# EAGLE design display (EAGLE 7.2.0)
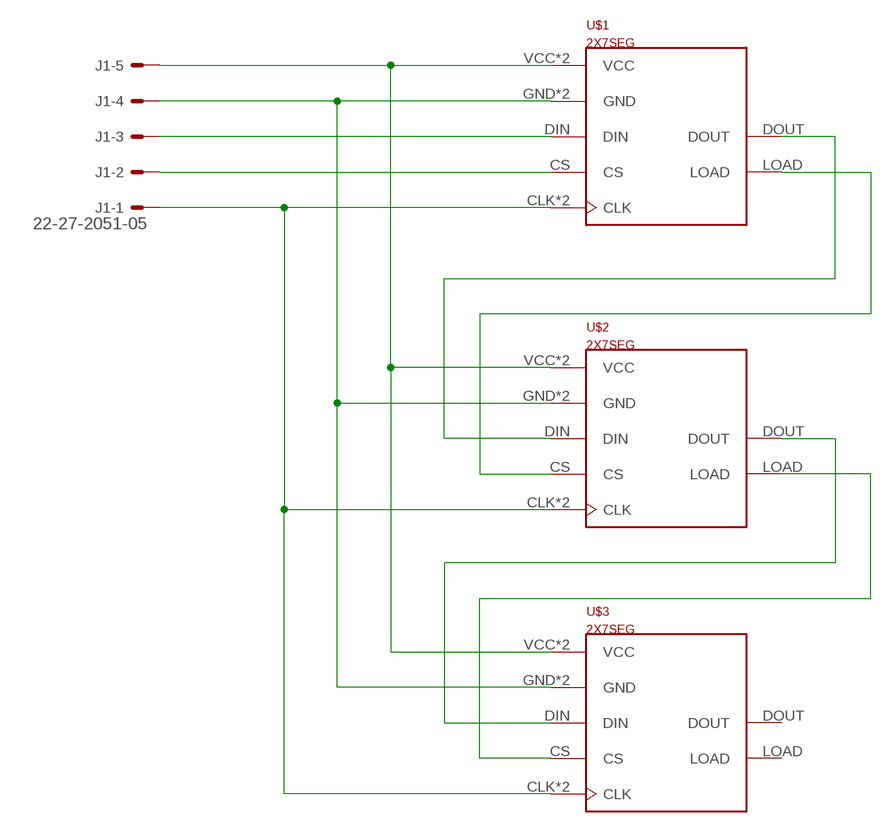
[diagram p0: schematic, sheet 1]

## Parts
J1  22-27-2051-05  [6410-05]
U$1  2X7SEG  [2X7SEG]
U$2  2X7SEG  [2X7SEG]
U$3  2X7SEG  [2X7SEG]

## Nets
N$1: J1.5 U$1.VCC U$1.VCC2(VCC) U$2.VCC U$2.VCC2(VCC) U$3.VCC U$3.VCC2(VCC)
N$2: J1.2 U$1.CS
N$3: J1.3 U$1.DIN
N$5: J1.1 U$1.CLK U$1.CLK2(CLK) U$2.CLK U$2.CLK2(CLK) U$3.CLK U$3.CLK2(CLK)
N$6: U$1.DOUT U$2.DIN
N$7: U$1.LOAD U$2.CS
N$8: U$2.DOUT U$3.DIN
N$9: U$2.LOAD U$3.CS
N$10: J1.4 U$1.GND U$1.GND2(GND) U$2.GND U$2.GND2(GND) U$3.GND U$3.GND2(GND)
Unconnected: U$3.DOUT U$3.LOAD

## Library data of the parts
J1 = con-molex:22-?-05: CONNECTOR wire to board 2.54 mm (.1 inch) pitch header; OC_FARNELL: unknown; OC_NEWARK: unknown
U$1-U$3 = arduino:2X7SEG

## Board
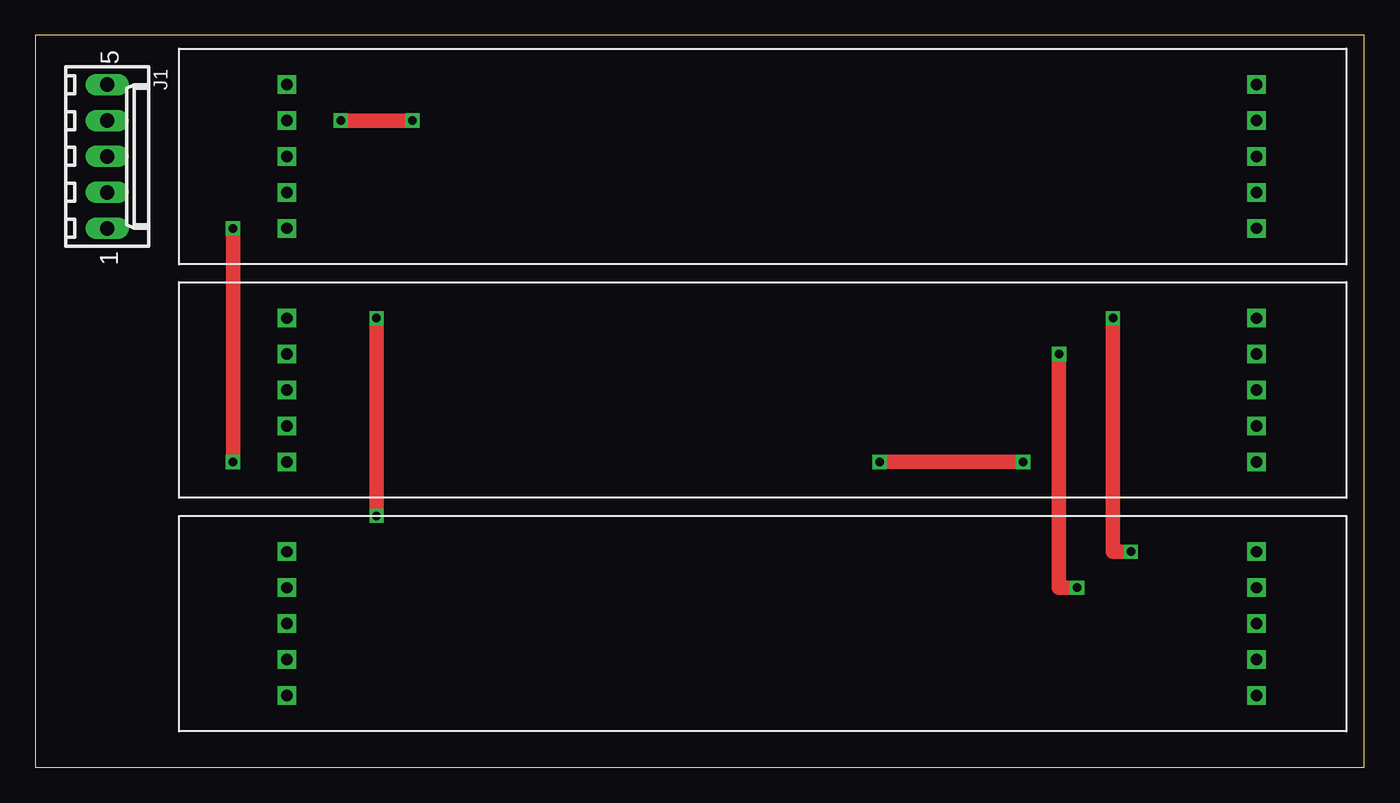
[diagram p1: board, top side]
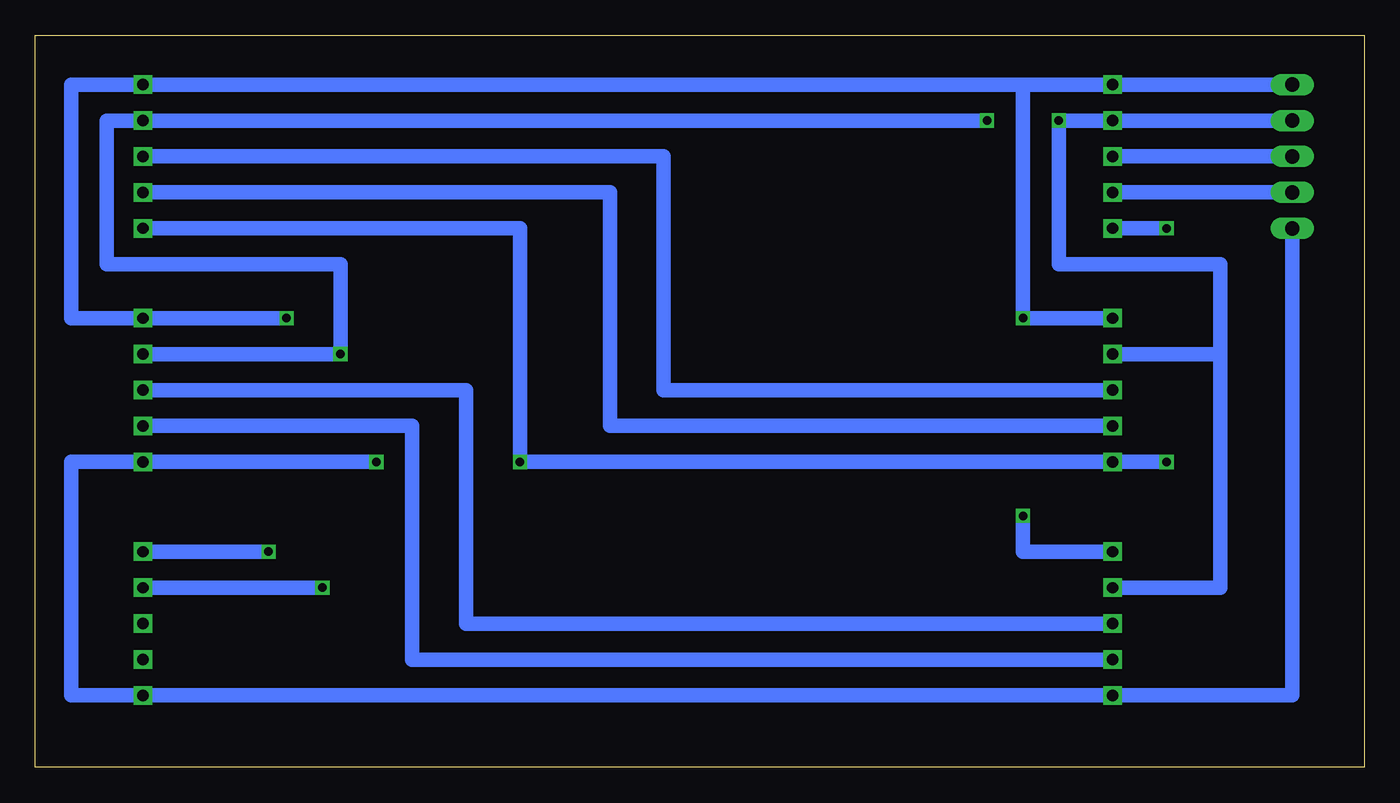
[diagram p2: board, bottom side, seen from below]

Size 93.96 x 51.74 mm. Coordinates in mm from the lower left corner, seen from the top.
Outline: 0,0 93.96,0 93.96,51.74 0,51.74 0,0
Copper layers (1*16): Top 0.035mm / dielectric 1.5mm / Bottom 0.035mm
Design rules "default": minimum track width 10mil, minimum drill 24mil, track to track 8mil, track to pad 8mil, pad to pad 8mil, via to via 8mil, smd to smd 8mil, copper to edge 40mil, drill to drill 8mil, minimum pad ring 10mil, minimum via ring 8mil, stop-mask expansion 4mil, vias tented up to drill 0mil, thermal gap 10mil

### Footprints (pad centres in the part's own frame; a part is rotated, then mirrored left to right if it is on the bottom)
6410-05 = drill 1.016 long: 1 5.08,0; 2 2.54,0; 3 0,0; 4 -2.54,0; 5 -5.08,0
2X7SEG = drill 0.8 square: CLK -35.56,-5.08; CLK2 33.02,-5.08; CS -35.56,-2.54; DIN -35.56,0; DOUT 33.02,0; GND -35.56,2.54; GND2 33.02,2.54; LOAD 33.02,-2.54; VCC -35.56,5.08; VCC2 33.02,5.08

### Placement (x,y rotation side)
J1  5.08,43.18 270 top
U$1  53.34,43.18 0 top
U$2  53.34,26.67 0 top
U$3  53.34,10.16 0 top

### Tracks (layer width: path | path; a pad name or v marks a point on that pad's centre or on a via)
N$1  (via drill 0.6)
  Top 1.016: v24.13,17.78 v24.13,31.75 | v77.47,15.24 76.2,15.24 v76.2,31.75
  Bottom 1.016: J1.5 U$1.VCC 24.13,48.26 | U$3.VCC 24.13,15.24 v24.13,17.78 | U$2.VCC v24.13,31.75 24.13,48.26 | 24.13,48.26 U$1.VCC2 91.44,48.26 91.44,31.75 U$2.VCC2 v76.2,31.75 | U$3.VCC2 v77.47,15.24
N$2
  Bottom 1.016: J1.2 U$1.CS
N$3
  Bottom 1.016: J1.3 U$1.DIN
N$5  (via drill 0.6)
  Top 1.016: v59.69,21.59 v69.85,21.59 | v13.97,38.1 v13.97,21.59
  Bottom 1.016: J1.1 5.08,5.08 U$3.CLK U$3.CLK2 91.44,5.08 91.44,21.59 U$2.CLK2 v69.85,21.59 | U$1.CLK v13.97,38.1 | v13.97,21.59 U$2.CLK v59.69,21.59 59.69,38.1 U$1.CLK2
N$6
  Bottom 1.016: U$2.DIN 49.53,26.67 49.53,43.18 U$1.DOUT
N$7
  Bottom 1.016: U$2.CS 53.34,24.13 53.34,40.64 U$1.LOAD
N$8
  Bottom 1.016: U$3.DIN 63.5,10.16 63.5,26.67 U$2.DOUT
N$9
  Bottom 1.016: U$3.CS 67.31,7.62 67.31,24.13 U$2.LOAD
N$10  (via drill 0.6)
  Top 1.016: v21.59,45.72 v26.67,45.72 | v73.66,12.7 72.39,12.7 v72.39,29.21
  Bottom 1.016: J1.4 U$1.GND v21.59,45.72 21.59,35.56 10.16,35.56 10.16,29.21 | U$3.GND 10.16,12.7 10.16,29.21 | 10.16,29.21 U$2.GND | v26.67,45.72 U$1.GND2 88.9,45.72 88.9,35.56 72.39,35.56 v72.39,29.21 U$2.GND2 | U$3.GND2 v73.66,12.7